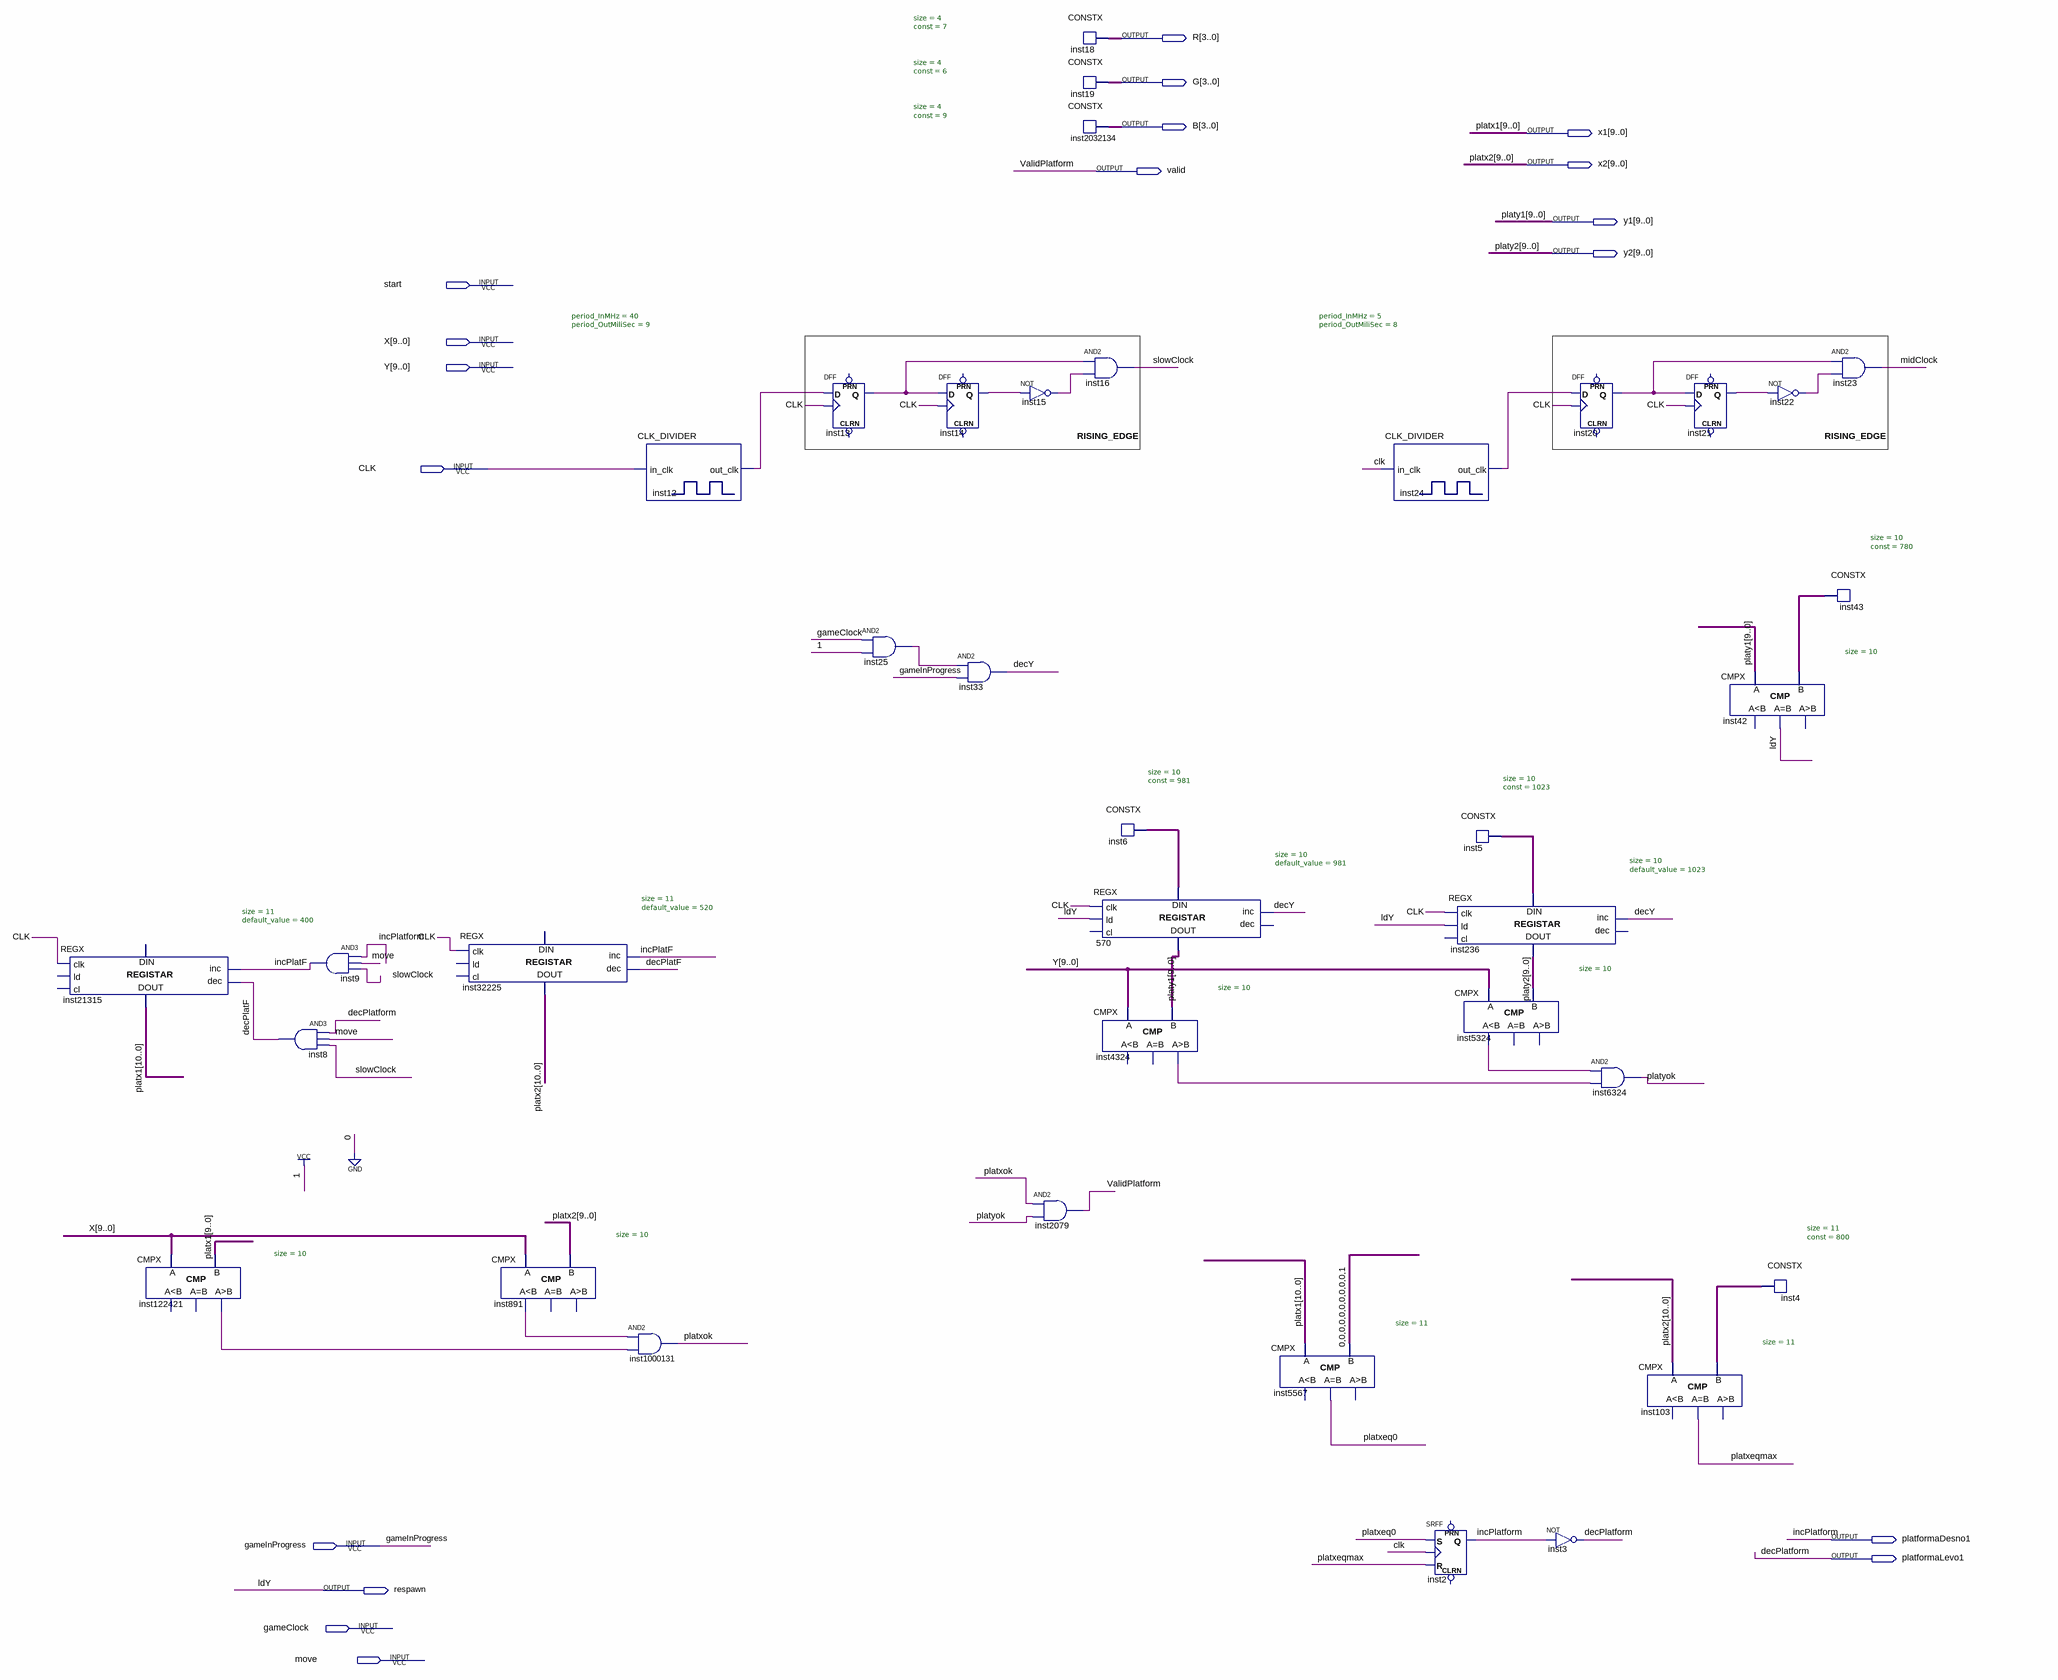
[diagram p0: schematic sheet]
// Quartus schematic Platform2Moving.bdf as structural Verilog: 37 symbols, 18 pins
module Platform2Moving (
  input  start,
  input  [9:0] X,
  input  [9:0] Y,
  input  CLK,
  input  gameInProgress,
  input  gameClock,
  input  move,
  output [3:0] R,
  output [3:0] G,
  output [3:0] B,
  output [9:0] x1,
  output [9:0] x2,
  output valid,
  output [9:0] y1,
  output [9:0] y2,
  output platformaDesno1,
  output platformaLevo1,
  output respawn
);

  wire decPlatF, decY, incPlatF, inst12_out_clk, inst13_q, inst14_q, inst15_out, inst20_q, inst21_q,
       inst22_out, inst24_out_clk, inst25_out, inst891_ls, inst4324_gr, inst5324_ls, inst122421_gr, midClock,
       platxeq0, platxeqmax, platxok, platyok, slowClock;
  wire [9:0] inst5_data, inst6_data, inst43_data;
  wire [10:0] inst4_data;
  wire [10:10] platx1, platx2;

  REGX #(.size(11), .default_value(400)) inst21315 (
    .clk(CLK), .inc(incPlatF), .dec(decPlatF), .data_out({platx1[10], x1}));  // open: ld, cl, data_in
  CMPX #(.size(10)) inst122421 (.A(X), .B(x1), .gr(inst122421_gr));  // open: ls, eq
  and inst8 (decPlatF, platformaLevo1, move, slowClock);
  and inst9 (incPlatF, platformaDesno1, move, slowClock);
  REGX #(.size(11), .default_value(520)) inst32225 (
    .clk(CLK), .inc(incPlatF), .dec(decPlatF), .data_out({platx2[10], x2}));  // open: ld, cl, data_in
  CMPX #(.size(10)) inst891 (.A(X), .B(x2), .ls(inst891_ls));  // open: eq, gr
  CLK_DIVIDER #(.period_InMHz(40), .period_OutMiliSec(9)) inst12 (.in_clk(CLK), .out_clk(inst12_out_clk));
  and inst1000131 (platxok, inst891_ls, inst122421_gr);
  DFF inst13 (.CLK(CLK), .D(inst12_out_clk), .Q(inst13_q));  // open: CLRN, PRN
  and inst25 (inst25_out, gameClock, 1'b1);
  DFF inst14 (.CLK(CLK), .D(inst13_q), .Q(inst14_q));  // open: CLRN, PRN
  and inst33 (decY, inst25_out, gameInProgress);
  not inst15 (inst15_out, inst14_q);
  and inst2079 (valid, platxok, platyok);
  CONSTX #(.size(4), .\const (7)) inst18 (.data(R));
  CONSTX #(.size(4), .\const (6)) inst19 (.data(G));
  CONSTX #(.size(4), .\const (9)) inst2032134 (.data(B));
  and inst16 (slowClock, inst13_q, inst15_out);
  CONSTX #(.size(10), .\const (981)) inst6 (.data(inst6_data));
  REGX #(.size(10), .default_value(981)) u_570 (
    .clk(CLK), .ld(respawn), .inc(decY), .data_in(inst6_data), .data_out(y1));  // open: cl, dec
  CMPX #(.size(10)) inst4324 (.A(Y), .B(y1), .gr(inst4324_gr));  // open: ls, eq
  CMPX #(.size(11)) inst5567 (.A({platx1[10], x1}), .B(11'b00000000001), .eq(platxeq0));  // open: ls, gr
  CLK_DIVIDER #(.period_InMHz(5), .period_OutMiliSec(8)) inst24 (.in_clk(CLK), .out_clk(inst24_out_clk));
  CONSTX #(.size(10), .\const (1023)) inst5 (.data(inst5_data));
  REGX #(.size(10), .default_value(1023)) inst236 (
    .clk(CLK), .ld(respawn), .inc(decY), .data_in(inst5_data), .data_out(y2));  // open: cl, dec
  CMPX #(.size(10)) inst5324 (.A(Y), .B(y2), .ls(inst5324_ls));  // open: eq, gr
  SRFF inst2 (.S(platxeq0), .R(platxeqmax), .CLK(CLK), .Q(platformaDesno1));  // open: PRN, CLRN
  not inst3 (platformaLevo1, platformaDesno1);
  DFF inst20 (.CLK(CLK), .D(inst24_out_clk), .Q(inst20_q));  // open: CLRN, PRN
  and inst6324 (platyok, inst5324_ls, inst4324_gr);
  CMPX #(.size(11)) inst103 (.A({platx2[10], x2}), .B(inst4_data), .eq(platxeqmax));  // open: ls, gr
  DFF inst21 (.CLK(CLK), .D(inst20_q), .Q(inst21_q));  // open: CLRN, PRN
  CMPX #(.size(10)) inst42 (.A(y1), .B(inst43_data), .eq(respawn));  // open: ls, gr
  not inst22 (inst22_out, inst21_q);
  CONSTX #(.size(11), .\const (800)) inst4 (.data(inst4_data));
  and inst23 (midClock, inst20_q, inst22_out);
  CONSTX #(.size(10), .\const (780)) inst43 (.data(inst43_data));

  // Other names for the same wires on the sheet: decPlatform = platformaLevo1; incPlatform = platformaDesno1;
  //   ldY = respawn; platx1[9:0] = x1; platx2[9:0] = x2; platy1[9:0] = y1; platy2[9:0] = y2; ValidPlatform = valid

  // Notes on the sheet:
  //   RISING_EDGE
  //   RISING_EDGE
endmodule
